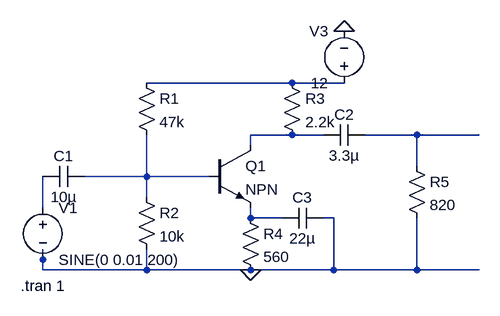
[diagram p0: schematic CE_configuration_lab.asc]
CE_configuration_lab.asc, the LTspice schematic file:
Version 4
SHEET 1 880 680
WIRE 256 16 32 16
WIRE 336 16 256 16
WIRE 256 96 192 96
WIRE 304 96 256 96
WIRE 448 96 368 96
WIRE 544 96 448 96
WIRE 192 112 192 96
WIRE 448 144 448 96
WIRE 32 160 32 96
WIRE 32 160 -64 160
WIRE 128 160 32 160
WIRE 32 192 32 160
WIRE -128 208 -128 160
WIRE 192 224 192 208
WIRE 240 224 192 224
WIRE 320 224 304 224
WIRE -128 288 -128 272
WIRE -128 304 -128 288
WIRE 32 304 32 272
WIRE 32 304 -128 304
WIRE 192 304 32 304
WIRE 320 304 320 224
WIRE 320 304 192 304
WIRE 448 304 448 224
WIRE 448 304 320 304
WIRE 544 304 448 304
FLAG 336 -64 0
FLAG 192 304 0
SYMBOL npn 128 112 R0
SYMATTR InstName Q1
SYMBOL res 16 0 R0
SYMATTR InstName R1
SYMATTR Value 47k
SYMBOL res 16 176 R0
SYMATTR InstName R2
SYMATTR Value 10k
SYMBOL res 240 0 R0
SYMATTR InstName R3
SYMATTR Value 2.2k
SYMBOL res 176 208 R0
SYMATTR InstName R4
SYMATTR Value 560
SYMBOL res 432 128 R0
SYMATTR InstName R5
SYMATTR Value 820
SYMBOL cap -64 144 R90
WINDOW 0 0 32 VBottom 2
WINDOW 3 32 32 VTop 2
SYMATTR InstName C1
SYMATTR Value 10µ
SYMBOL cap 368 80 R90
WINDOW 0 0 32 VBottom 2
WINDOW 3 32 32 VTop 2
SYMATTR InstName C2
SYMATTR Value 3.3µ
SYMBOL cap 304 208 R90
WINDOW 0 0 32 VBottom 2
WINDOW 3 32 32 VTop 2
SYMATTR InstName C3
SYMATTR Value 22µ
SYMBOL voltage -128 192 R0
WINDOW 123 0 0 Left 0
WINDOW 39 0 0 Left 0
SYMATTR InstName V1
SYMATTR Value SINE(0 0.01 200)
SYMBOL voltage 336 32 R180
WINDOW 0 24 96 Left 2
WINDOW 3 24 16 Left 2
WINDOW 123 0 0 Left 0
WINDOW 39 0 0 Left 0
SYMATTR InstName V3
SYMATTR Value 12
TEXT -162 328 Left 2 !.tran 1

The netlist it stands for:
* CE_configuration_lab.asc
Q1 N002 N004 N006 0 NPN
R1 N001 N004 47k
R2 N004 0 10k
R3 N001 N002 2.2k
R4 N006 0 560
R5 N003 0 820
C1 N004 N005 10µ
C2 N003 N002 3.3µ
C3 0 N006 22µ
V1 N005 0 SINE(0 0.01 200)
V3 N001 0 12
.model NPN NPN
.model PNP PNP
.lib standard.bjt
.tran 1
.backanno
.end